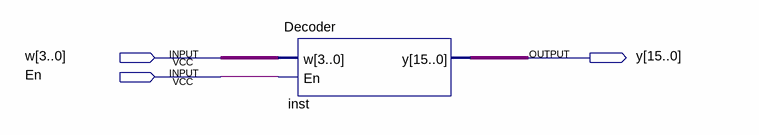
[diagram p0: schematic sheet]
// Quartus schematic DecoderDiagram.bdf as structural Verilog: 1 symbols, 3 pins
module DecoderDiagram (
  input  [3:0] w,
  input  En,
  output [15:0] y
);

  Decoder inst (.w(w), .En(En), .y(y));
endmodule
